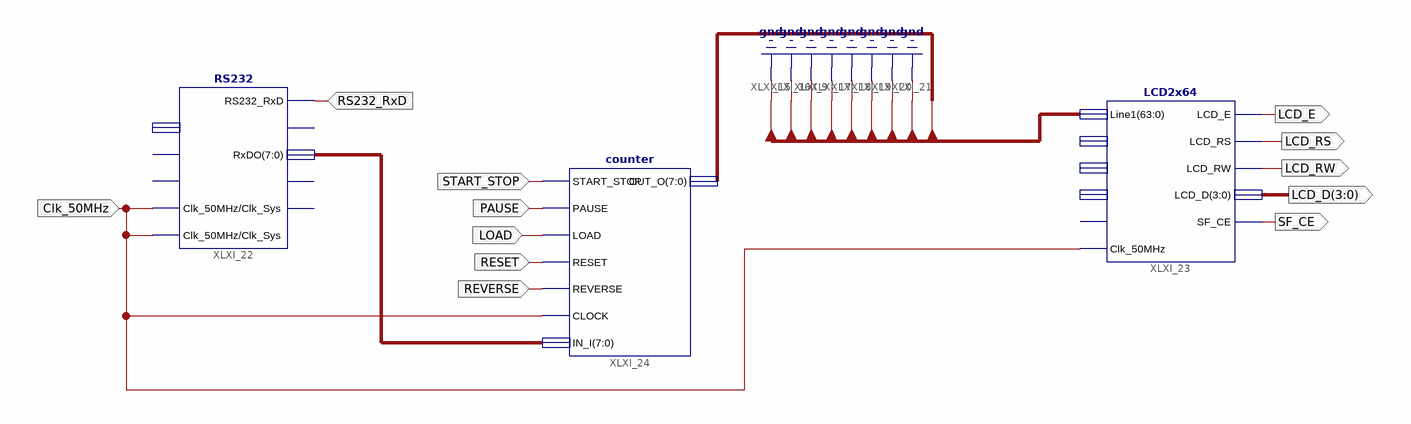
[diagram p0: schematic sheet 1]
// Xilinx ISE schematic przystawka.sch (spartan3e) as structural Verilog: 3 symbols, 12 ports
module przystawka (
  input  RS232_RxD,
  input  START_STOP,
  input  PAUSE,
  input  RESET,
  input  REVERSE,
  input  Clk_50MHz,
  input  LOAD,
  output [3:0] LCD_D,
  output SF_CE,
  output LCD_E,
  output LCD_RW,
  output LCD_RS
);

  wire [7:0] XLXN_6;
  wire [63:0] DI;

  RS232 XLXI_22 (
    .Clk_50MHz(Clk_50MHz), .RS232_RxD(RS232_RxD), .RxDO(XLXN_6), .Clk_Sys(Clk_50MHz));  // open: Reset, TxStart, TxDI, TxBusy, RxRdy, RS232_TxD
  LCD2x64 XLXI_23 (
    .Line1({DI[63:16], {8{1'b0}}, DI[7:0]}), .LCD_D(LCD_D), .LCD_E(LCD_E), .LCD_RW(LCD_RW), .LCD_RS(LCD_RS),
    .SF_CE(SF_CE), .Clk_50MHz(Clk_50MHz));  // open: Blank1, Line2, Blank2, Reset
  counter XLXI_24 (
    .START_STOP(START_STOP), .PAUSE(PAUSE), .LOAD(LOAD), .RESET(RESET), .REVERSE(REVERSE), .CLOCK(Clk_50MHz),
    .IN_I(XLXN_6), .OUT_O(DI[7:0]));
endmodule
